# EAGLE design qo-100-digital-power-meter (EAGLE 9.6.1)
CNAME: None; CREVISION: 1; DESIGNER: Joao Silva
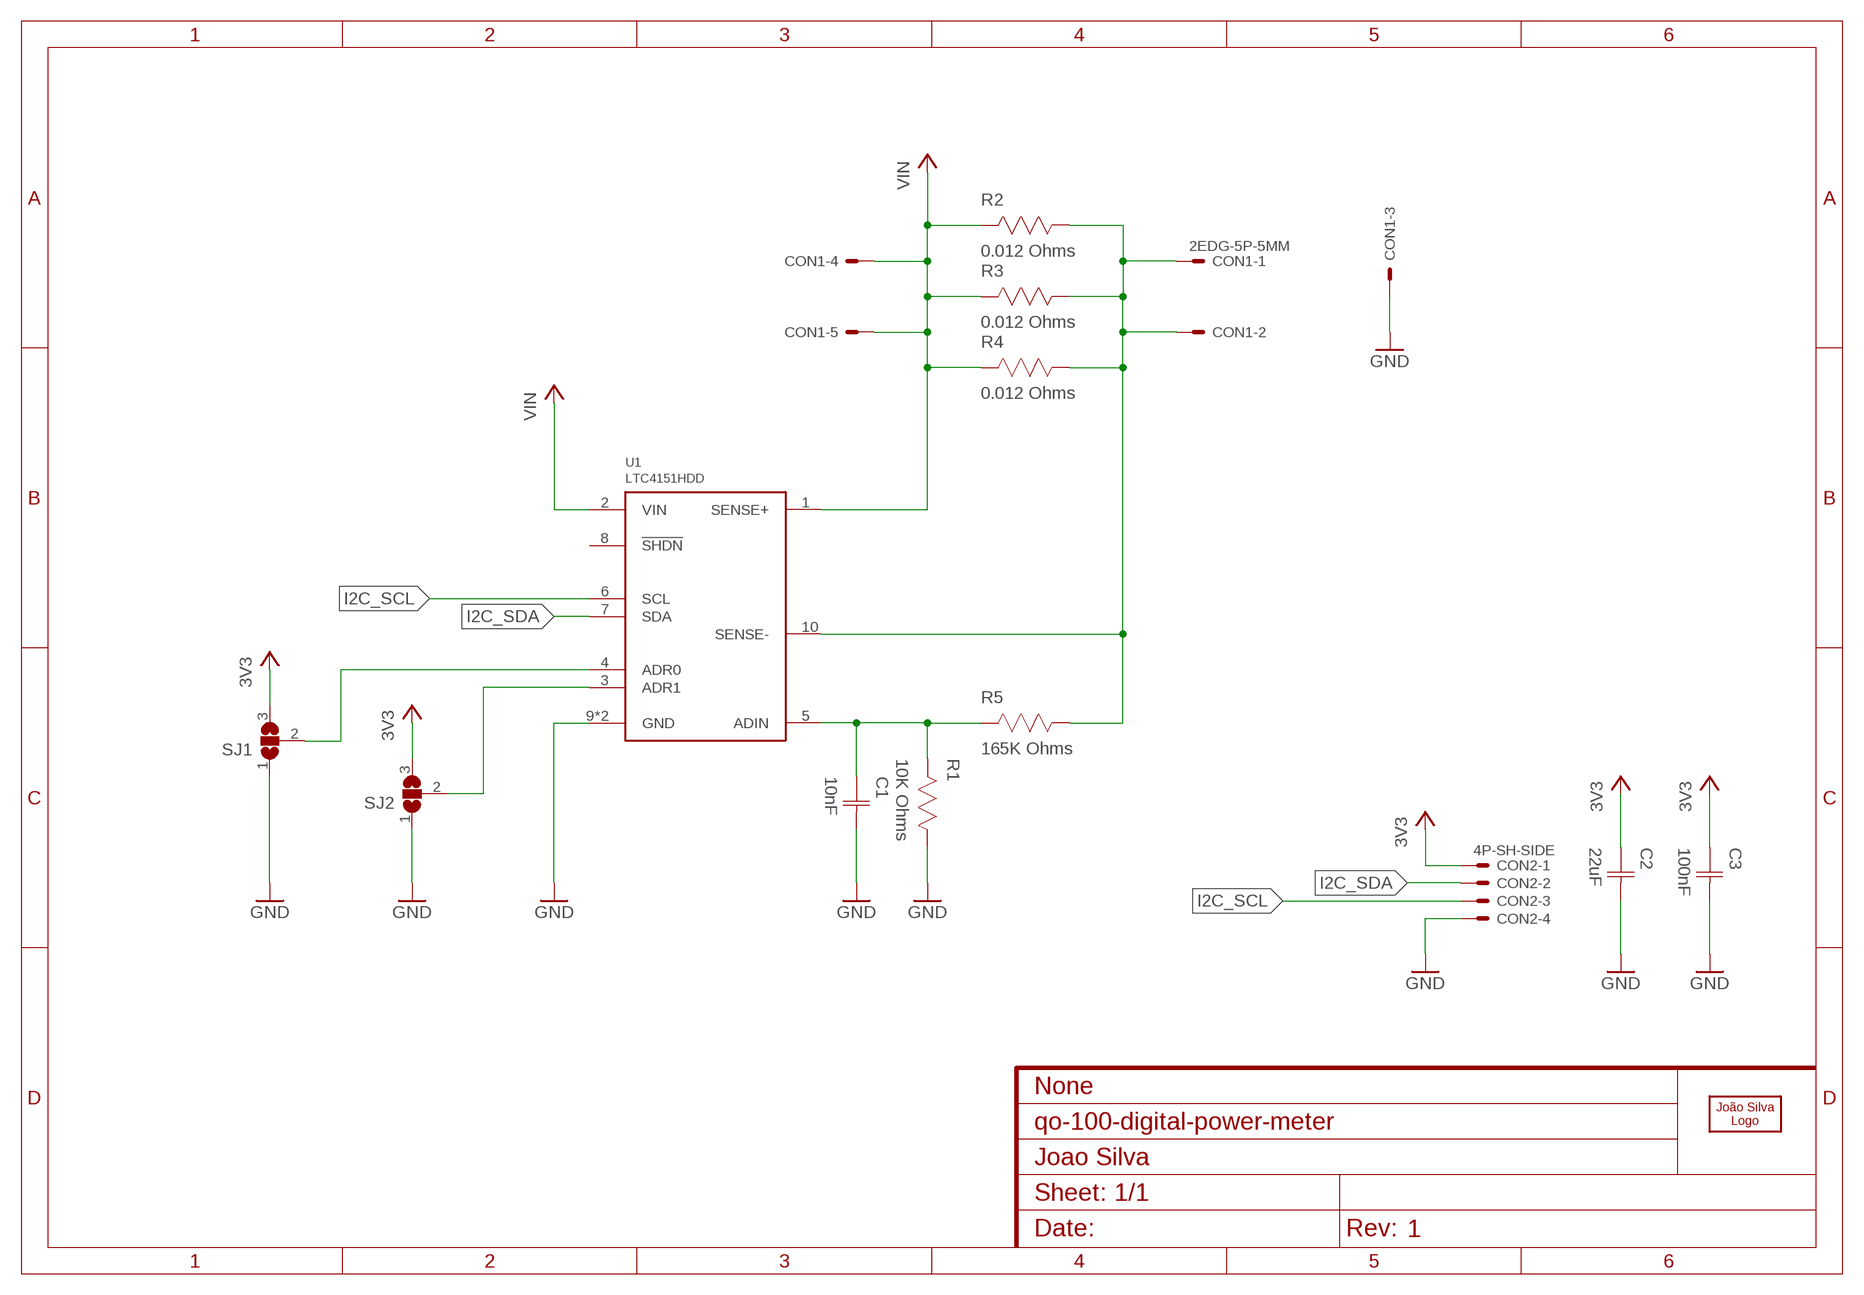
[diagram p0: schematic, sheet 1]

## Parts
C1  10nF  CAPACITOR-0603  [CAP0603]
C2  22uF  CAPACITOR-1206  [CAP1206]
C3  100nF  CAPACITOR-0603  [CAP0603]
CON1  2EDG-5P-5MM  [2EDG-5P-5MM]
CON2  4P-SH-SIDE  [SH-04-SIDE]
LOGO1  JS-5MM  [JS_5MM]
R1  10K Ohms  RESISTOR-0603  [RES0603]
R2  0.012 Ohms  RESISTOR-2512  [RES2512]
R3  0.012 Ohms  RESISTOR-2512  [RES2512]
R4  0.012 Ohms  RESISTOR-2512  [RES2512]
R5  165K Ohms  RESISTOR-0603  [RES0603]
SJ1  SJ2S  [SJ2_S]
SJ2  SJ2S  [SJ2_S]
U1  LTC4151HDD  [DFN10]

## Nets
3V3: C2.1(C1) C3.1(C1) CON2.1 SJ1.3 SJ2.3
GND: C1.2(C2) C2.2(C2) C3.2(C2) CON1.P$3 CON2.4 R1.1 SJ1.1 SJ2.1 U1.9(GND) U1.11(GND)
I2C_SCL: CON2.3 U1.6(SCL)
I2C_SDA: CON2.2 U1.7(SDA)
N$1: C1.1(C1) R1.2 R5.2 U1.5(ADIN)
N$2 [80V isolation]: CON1.P$1 CON1.P$2 R2.1 R3.1 R4.1 R5.1 U1.10(SENSE-)
N$3: SJ1.2 U1.4(ADR0)
N$4: SJ2.2 U1.3(ADR1)
VIN [80V isolation]: CON1.P$4 CON1.P$5 R2.2 R3.2 R4.2 U1.1(SENSE+) U1.2(VIN)
Unconnected: U1.8(!SHDN)

## Library data of the parts
C1-C3 = Capacitor:CAPACITOR
CON1 = Generic Connector:2EDG-5P
CON2 = JST:4P: Disconnectable Crimp style connector, 1.0mm pitch 4 contacts
LOGO1 = Silkscreen:JS
R1-R5 = Resistor:RESISTOR
SJ1 SJ2 = Solder Jumper:SJ2
U1 = Analog Devices:LTC4151*?

## Net classes
1 80V isolation: clearance 0.2 mm

## Board
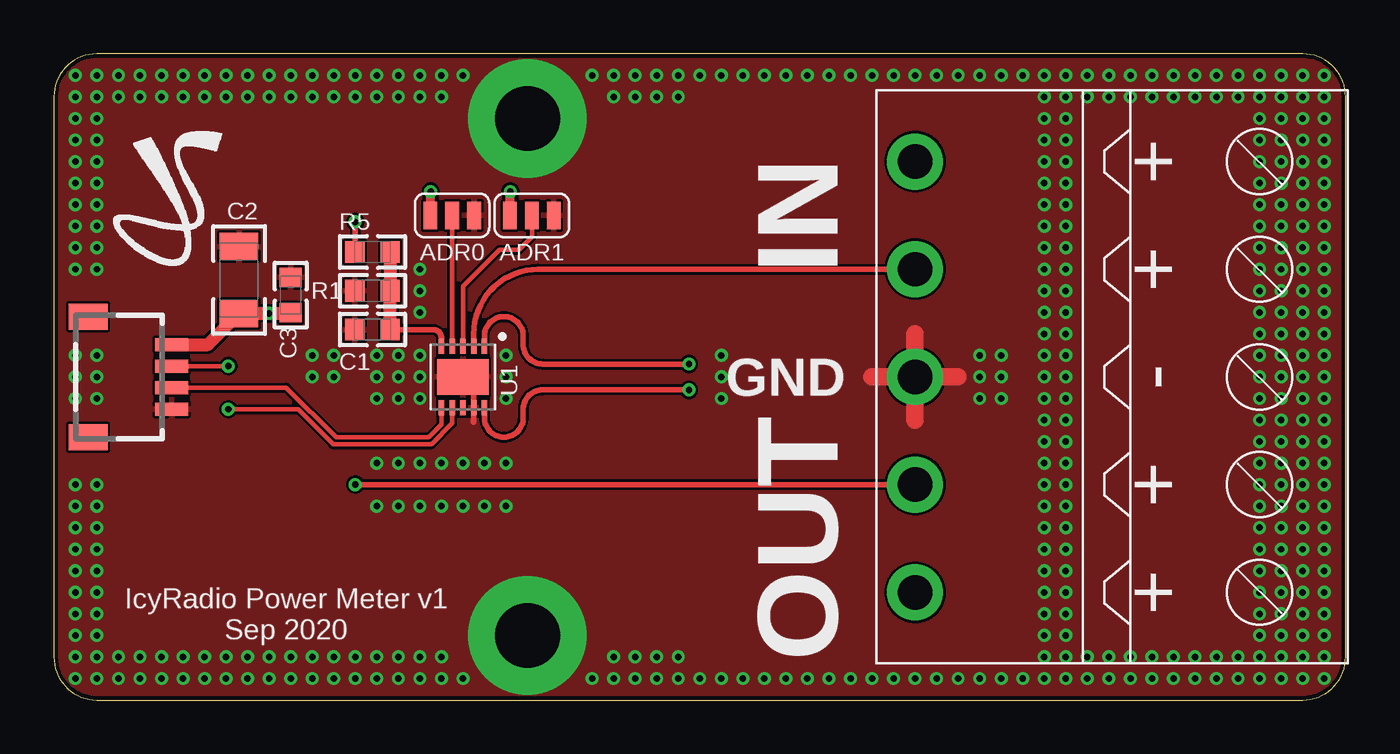
[diagram p1: board, top side]
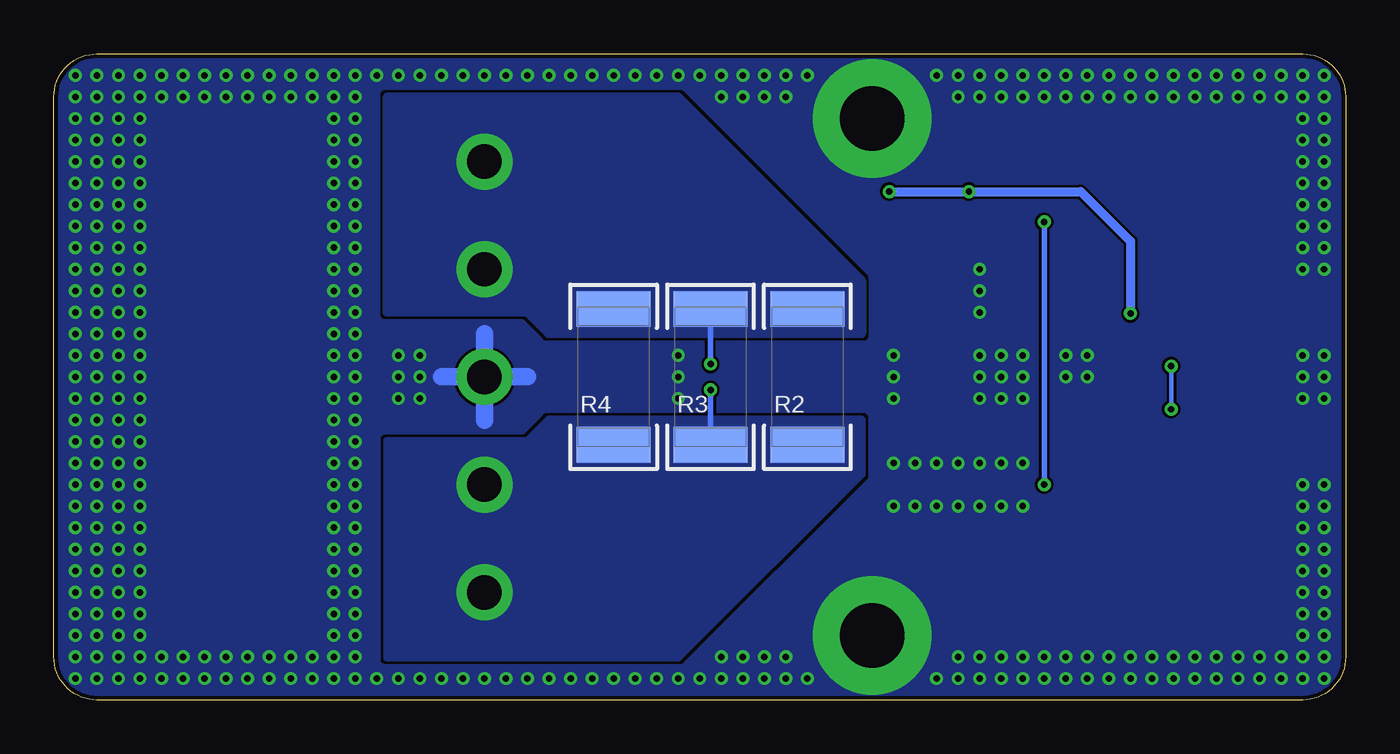
[diagram p2: board, bottom side, seen from below]

Size 60 x 30 mm. Coordinates in mm from the lower left corner, seen from the top.
Outline: 0,28 0,2 arc90 2,0 58,0 arc90 60,2 60,28 arc90 58,30 2,30 arc90 0,28
Copper layers (1*16): Top 0.035mm / dielectric 1.6mm / Bottom 0.035mm
Design rules "jlcpcb_2layer": minimum track width 5mil, minimum drill 0.3mm, track to track 5mil, track to pad 5mil, pad to pad 5mil, via to via 5mil, smd to smd 5mil, copper to edge 0.2mm, drill to drill 5mil, minimum pad ring 3mil, minimum via ring 3mil, stop-mask expansion 0.075mm, vias tented up to drill 10mm, thermal gap 5mil

### Footprints (pad centres in the part's own frame; a part is rotated, then mirrored left to right if it is on the bottom)
CAP0603 = smd 0.889 x 1.016: 1 -0.819,0; 2 0.819,0
CAP1206 = smd 1.27 x 1.778: 1 -1.549,0; 2 1.549,0
2EDG-5P-5MM = drill 1.6 pad 2.6: P$1 -10,0; P$2 -5,0; P$3 0,0; P$4 5,0; P$5 10,0
SH-04-SIDE = smd 0.6 x 1.55: 1 -1.5,2.975; 2 -0.5,2.975; 3 0.5,2.975; 4 1.5,2.975 | smd 1.2 x 1.8: FIT@1 -2.8,-0.9; FIT@2 2.8,-0.9
RES0603 = smd 0.889 x 1.016: 1 -0.819,0; 2 0.819,0
RES2512 = smd 1.651 x 3.429: 1 -3.15,0; 2 3.15,0
SJ2_S = smd 0.635 x 1.27: 1 -1.016,0; 2 0,0; 3 1.016,0
DFN10 = smd 0.7 x 0.25: 1 -1.425,1; 2 -1.425,0.5; 3 -1.425,0; 4 -1.425,-0.5; 5 -1.425,-1; 6 1.425,-1; 7 1.425,-0.5; 8 1.425,0; 9 1.425,0.5; 10 1.425,1 | smd 1.65 x 2.38: 11 0,0

### Placement (x,y rotation side)
C1  14.8,17.2 180 top
C2  8.6,19.5 90 top
C3  11,18.8 90 top
CON1  40,15 90 top
CON2  2.5,15 270 top
LOGO1  8,26.6 0 top
R1  14.8,19 0 top
R2  25,15 90 bottom
R3  29.5,15 90 bottom
R4  34,15 90 bottom
R5  14.8,20.8 0 top
SJ1  18.5,22.5 180 top
SJ2  22.2,22.5 180 top
U1  19,15 270 top

### Tracks (layer width: path | path; a pad name or v marks a point on that pad's centre or on a via)
3V3  (via drill 0.3)
  Top 0.406: SJ2.3 21.18,23.58 v21.2,23.6 | v17.5,23.6 17.48,23.58 SJ1.3
  Top 0.61: CON2.1 7.15,16.5 C2.1 v10,17.95 10.97,17.95 C3.1
  Bottom 0.406: v21.2,23.6 v17.5,23.6 12.3,23.6 10,21.3 v10,17.95
GND  (via drill 0.3, 3 pad 5.5)
  Top 0.254: U1.11 19.5,14.5 U1.9 19.5,12.9
  Top 0.813: CON1.P$3 40,17 | CON1.P$3 38,15 | CON1.P$3 42,15 | CON1.P$3 40,13
  Bottom 0.813: CON1.P$3 42,15 | CON1.P$3 40,13 | CON1.P$3 38,15 | CON1.P$3 40,17
  other vias: 22,27 22,3 2,14 2,15 2,16 1,16 1,15 1,14 2,1 18,1 18,2 19,1 1,1 2,8 2,9 2,10 1,10 1,9 1,8 2,5 2,6 2,7 1,7 1,6 1,5 2,2 2,3 2,4 1,4 1,3 1,2 5,2 4,2 3,2 3,1 4,1 5,1 8,2 7,2 6,2 6,1 7,1 8,1 11,2 10,2 9,2 9,1 10,1 11,1 14,2 13,2 12,2 12,1 13,1 14,1 17,2 16,2 15,2 15,1 16,1 17,1 2,25 2,26 2,27 1,27 1,26 1,25 2,22 2,23 2,24 1,24 1,23 1,22 2,20 2,21 1,21 1,20 2,28 18,28 18,29 19,29 1,28 2,29 1,29 5,29 4,29 3,29 3,28 4,28 5,28 8,29 7,29 6,29 6,28 7,28 8,28 11,29 10,29 9,29 9,28 10,28 11,28 14,29 13,29 12,29 12,28 13,28 14,28 17,29 16,29 15,29 15,28 16,28 17,28 26,28 42,1 42,29 26,29 25,29 29,29 28,29 27,29 27,28 28,28 29,28 32,29 31,29 30,29 30,1 31,1 32,1 35,29 34,29 33,29 33,1 34,1 35,1 38,29 37,29 36,29 36,1 37,1 38,1 41,29 40,29 39,29 39,1 40,1 41,1 48,28 59,26 58,26 47,28 48,29 47,29 51,29 50,29 49,29 49,28 50,28 51,28 54,29 53,29 52,29 52,28 53,28 54,28 57,29 56,29 55,29 55,28 56,28 57,28 59,27 59,29 58,29 58,28 59,28 58,27 58,25 58,24 58,23 59,23 59,24 59,25 46,29 45,29 44,29 43,29 47,1 46,1 47,2 46,2 50,2 49,2 48,2 48,1 49,1 50,1 53,2 52,2 51,2 51,1 52,1 53,1 56,2 55,2 54,2 54,1 55,1 56,1 58,2 57,2 57,1 58,1 45,1 44,1 43,1 46,28 59,2 59,1 59,5 59,4 58,5 58,4 58,8 58,7 58,6 59,6 59,7 59,8 58,3 59,3 59,11 59,10 58,11 58,10 58,14 58,13 58,12 59,12 59,13 59,14 58,17 58,16 58,15 59,15 59,16 59,17 58,20 58,19 58,18 59,18 59,19 59,20 58,22 58,21 59,21 59,22 58,9 59,9 57,26 56,26 57,27 56,27 56,25 56,24 56,23 57,23 57,24 57,25 57,5 57,4 56,5 56,4 56,8 56,7 56,6 57,6 57,7 57,8 56,3 57,3 57,11 57,10 56,11 56,10 56,14 56,13 56,12 57,12 57,13 57,14 56,17 56,16 56,15 57,15 57,16 57,17 56,20 56,19 56,18 57,18 57,19 57,20 56,22 56,21 57,21 57,22 56,9 57,9 47,26 46,26 47,27 46,27 46,25 46,24 46,23 47,23 47,24 47,25 47,5 47,4 46,5 46,4 46,8 46,7 46,6 47,6 47,7 47,8 46,3 47,3 47,11 47,10 46,11 46,10 46,14 46,13 46,12 47,12 47,13 47,14 46,17 46,16 46,15 47,15 47,16 47,17 46,20 46,19 46,18 47,18 47,19 47,20 46,22 46,21 47,21 47,22 46,9 47,9 43,14 44,14 43,16 43,15 44,15 44,16 29,1 29,2 27,1 28,1 28,2 27,2 26,1 26,2 25,1 13,15 13,16 12,16 12,15 17,14 17,15 17,16 16,16 16,15 16,14 15,16 15,15 15,14 21,16 21,15 21,14 17,20 17,19 17,18 21,11 18,11 19,11 20,11 15,11 16,11 17,11 21,9 18,9 19,9 20,9 15,9 16,9 17,9 31,16 31,15 31,14
  pour Top (rank 6): -1,31 61,31 61,-1 -1,-1
  pour Bottom (rank 6): -2,32 62,32 62,-2 -2,-2
I2C_SCL
  Top 0.2: CON2.3 10.8,14.5 13.1,12.2 17.4,12.2 18,12.8 U1.6
I2C_SDA  (via drill 0.3)
  Top 0.2: CON2.2 v8.1,15.5 | v8.1,13.5 11.34,13.5 12.96,11.87 17.54,11.87 18.5,12.84 U1.7
  Bottom 0.2: v8.1,15.5 v8.1,13.5
N$1
  Top 0.254: U1.5 18,16.8 arc90 17.6,17.2 C1.1
  Top 0.61: R5.2 R1.2 C1.1
N$2  (via drill 0.3)
  Top 0.254: U1.10 20,13.1 arc90 20.9,12.2 arc90 21.8,13.1 21.8,13.5 arc-90 22.7,14.4 v29.5,14.4 | v14,22.2 14,20.82 R5.1 | CON1.P$2 v14,10
  Bottom 0.254: v29.5,14.4 R3.1 | v14,10 v14,22.2
  pour Bottom (no thermals): 44.5,2 31,2 22.5,10.5 22.5,13 37,13 38,12 44.5,12
N$3
  Top 0.2: U1.4 SJ1.2
N$4
  Top 0.2: U1.3 19,19.2 20.7,20.9 21.6,20.9 22.2,21.5 SJ2.2
VIN  (via drill 0.3)
  Top 0.254: U1.1 20,16.9 arc-90 20.9,17.8 arc-90 21.8,16.9 21.8,16.5 arc90 22.7,15.6 v29.5,15.6 | U1.2 19.5,17 arc-90 22.5,20 CON1.P$4
  Bottom 0.254: v29.5,15.6 R3.2
  pour Bottom (no thermals): 22.5,17 37,17 38,18 44.5,18 44.5,28 31,28 22.5,19.5

### Text on the board
tPlace: + | IN | ADR0 | ADR1 | + | GND | - | + | OUT | + | IcyRadio Power Meter v1 / Sep 2020